# Altium project KLogShield_Interface_Rev1.PrjPcb
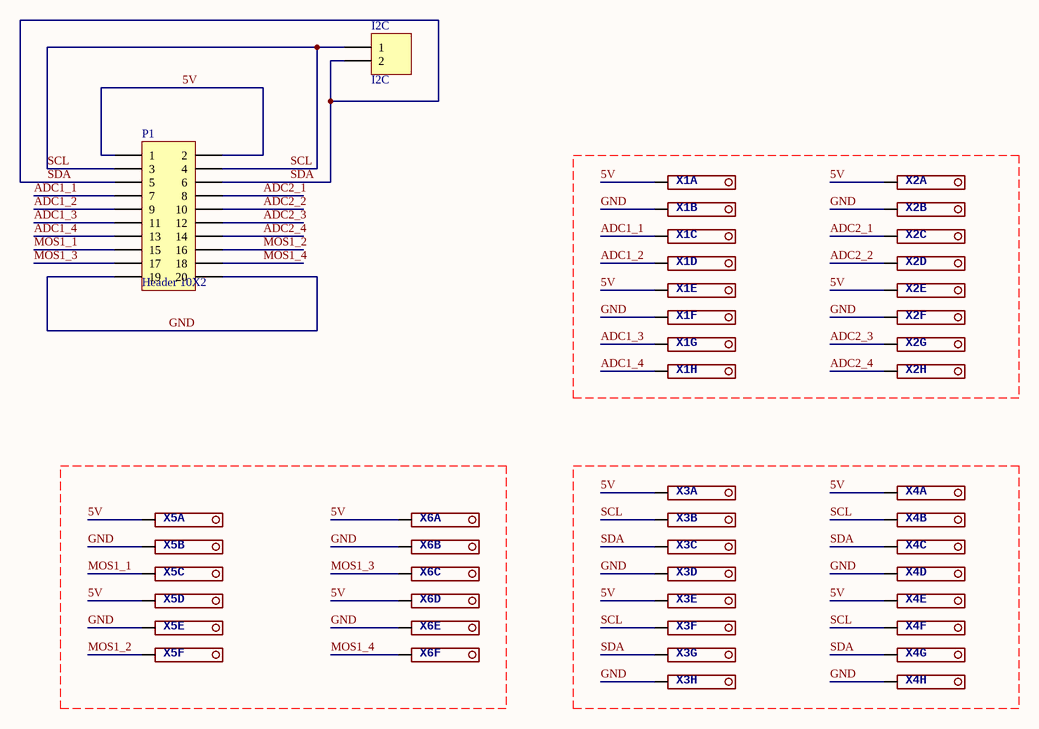
[diagram p0: KLogShield_Interface_Rev1.SchDoc]
1 sheet, 8 parts. Net scope: global (net labels, ports and power ports of the same name join across sheets).

## Sheet KLogShield_Interface_Rev1.SchDoc
size A

### Parts
I2C  I2C  [HDR1X2]
P1  Header 10X2  [HDR2X10]
X1  (no value)  [1751303]  (parts A,B,C,D,E,F,G,H of 8)
X2  (no value)  [1751303]  (parts A,B,C,D,E,F,G,H of 8)
X3  (no value)  [1751303]  (parts A,B,C,D,E,F,G,H of 8)
X4  (no value)  [1751303]  (parts A,B,C,D,E,F,G,H of 8)
X5  (no value)  [1751280]  (parts A,B,C,D,E,F of 6)
X6  (no value)  [1751280]  (parts A,B,C,D,E,F of 6)

### Nets
5V: P1.1 P1.2 X1.1(K) X1.5(K) X2.1(K) X2.5(K) X3.1(K) X3.5(K) X4.1(K) X4.5(K) X5.1(K) X5.4(K) X6.1(K) X6.4(K)
ADC1_1: P1.7 X1.3(K)
ADC1_2: P1.9 X1.4(K)
ADC1_3: P1.11 X1.7(K)
ADC1_4: P1.13 X1.8(K)
ADC2_1: P1.8 X2.3(K)
ADC2_2: P1.10 X2.4(K)
ADC2_3: P1.12 X2.7(K)
ADC2_4: P1.14 X2.8(K)
GND: P1.19 P1.20 X1.2(K) X1.6(K) X2.2(K) X2.6(K) X3.4(K) X3.8(K) X4.4(K) X4.8(K) X5.2(K) X5.5(K) X6.2(K) X6.5(K)
MOS1_1: P1.15 X5.3(K)
MOS1_2: P1.16 X5.6(K)
MOS1_3: P1.17 X6.3(K)
MOS1_4: P1.18 X6.6(K)
SCL: I2C.1 P1.3 P1.4 X3.2(K) X3.6(K) X4.2(K) X4.6(K)
SDA: I2C.2 P1.5 P1.6 X3.3(K) X3.7(K) X4.3(K) X4.7(K)

### Library data of the parts
I2C = Header 2: Header, 2-Pin; LatestRevisionDate: 17-Jul-2002; LatestRevisionNote: Re-released for DXP Platform.; Publisher: Altium Limited
P1 = Header 10X2: Header, 10-Pin, Dual row; LatestRevisionDate: 17-Jul-2002; LatestRevisionNote: Re-released for DXP Platform.; Publisher: Altium Limited
X1-X4 = 1751303: OC_FARNELL: unknown; OC_NEWARK: unknown
X5 X6 = 1751280: MPN: 1751280; OC_FARNELL: unknown; OC_NEWARK: 27R1765